# EAGLE design test (EAGLE 9.0.0)
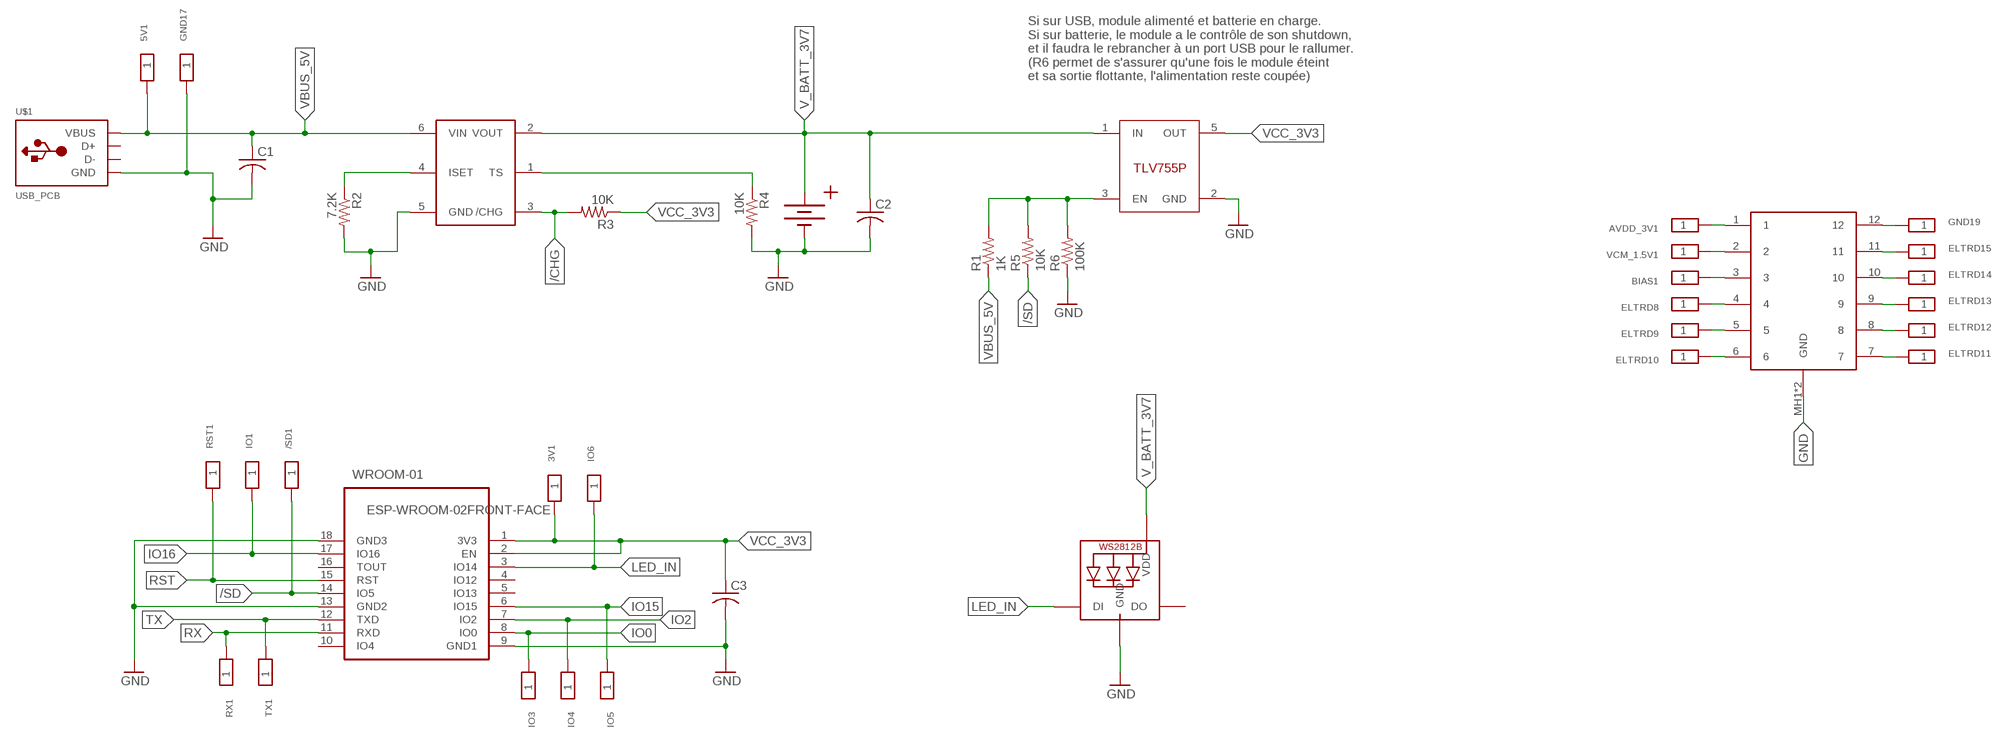
[diagram p0: schematic, sheet 1]

## Parts
3V1  TESTPAD_PROG  [TP1.5MM]
5V1  TESTPAD_PROG  [TP1.5MM]
/SD1  TESTPAD_PROG  [TP1.5MM]
AVDD_3V1  TESTPAD_PROG  [TP1.5MM]
BIAS1  TESTPAD_PROG  [TP1.5MM]
C1  C-USC0603  [C0603]
C2  C-USC0603  [C0603]
C3  C-USC0603  [C0603]
CHG1  BQ21040  [SOT23-6]
CONN1  505110-1292  [505110-1292]
ELTRD8  TESTPAD_PROG  [TP1.5MM]
ELTRD9  TESTPAD_PROG  [TP1.5MM]
ELTRD10  TESTPAD_PROG  [TP1.5MM]
ELTRD11  TESTPAD_PROG  [TP1.5MM]
ELTRD12  TESTPAD_PROG  [TP1.5MM]
ELTRD13  TESTPAD_PROG  [TP1.5MM]
ELTRD14  TESTPAD_PROG  [TP1.5MM]
ELTRD15  TESTPAD_PROG  [TP1.5MM]
GND17  TESTPAD_PROG  [TP1.5MM]
GND19  TESTPAD_PROG  [TP1.5MM]
IO1  TESTPAD_PROG  [TP1.5MM]
IO3  TESTPAD_PROG  [TP1.5MM]
IO4  TESTPAD_PROG  [TP1.5MM]
IO5  TESTPAD_PROG  [TP1.5MM]
IO6  TESTPAD_PROG  [TP1.5MM]
LDO1  TLV755P  [SOT23-5]
LED1  WS2812B5050  [WS2812B]
R1  1K  R-US_R0603  [R0603]
R2  7.2K  R-US_R0603  [R0603]
R3  10K  R-US_R0603  [R0603]
R4  10K  R-US_R0603  [R0603]
R5  10K  R-US_R0603  [R0603]
R6  100K  R-US_R0603  [R0603]
RST1  TESTPAD_PROG  [TP1.5MM]
RX1  TESTPAD_PROG  [TP1.5MM]
TX1  TESTPAD_PROG  [TP1.5MM]
U$1  USB_PCB  [USB_PADS]
U$3  BATT  [BATT_CON]
VCM_1.5V1  TESTPAD_PROG  [TP1.5MM]
WROOM-01  ESP-WROOM-02FRONT-FACE  [FRONT-FACE]

## Nets
/CHG: CHG1.3(/CHG) R3.2
/SD: /SD1.1 R5.1 WROOM-01.14(IO5)
AVDD_3V1: AVDD_3V1.1 CONN1.1
BIAS1: BIAS1.1 CONN1.3
ELTRD8: CONN1.4 ELTRD8.1
ELTRD9: CONN1.5 ELTRD9.1
ELTRD10: CONN1.6 ELTRD10.1
ELTRD11: CONN1.7 ELTRD11.1
ELTRD12: CONN1.8 ELTRD12.1
ELTRD13: CONN1.9 ELTRD13.1
ELTRD14: CONN1.10 ELTRD14.1
ELTRD15: CONN1.11 ELTRD15.1
EN1: LDO1.3(EN) R1.2 R5.2 R6.2
GND: C1.2 C2.2 C3.2 CHG1.5(GND) CONN1.MH1(GND) CONN1.MH2(GND) GND17.1 LDO1.2(GND) LED1.3-GND(GND) R2.2 R4.2 R6.1 U$1.GND U$3.V-(-) WROOM-01.9(GND1) WROOM-01.13(GND2) WROOM-01.18(GND3)
IO0: IO3.1 WROOM-01.8(IO0)
IO2: IO4.1 WROOM-01.7(IO2)
IO15: IO5.1 WROOM-01.6(IO15)
IO16: IO1.1 WROOM-01.17(IO16)
ISET1: CHG1.4(ISET) R2.1
LED_IN: IO6.1 LED1.4-DIN(DI) WROOM-01.3(IO14)
N$1: CONN1.12 GND19.1
RST: RST1.1 WROOM-01.15(RST)
RX: RX1.1 WROOM-01.11(RXD)
TS1: CHG1.1(TS) R4.1
TX: TX1.1 WROOM-01.12(TXD)
V_BATT_3V7: C2.1 CHG1.2(VOUT) LDO1.1(IN) LED1.1-VDD(VDD) U$3.V+(+)
VBUS_5V: 5V1.1 C1.1 CHG1.6(VIN) R1.1 U$1.V_SUPPLY(VBUS)
VCC_3V3: 3V1.1 C3.1 LDO1.5(OUT) R3.1 WROOM-01.1(3V3) WROOM-01.2(EN)
VCM_1.5V1: CONN1.2 VCM_1.5V1.1
Unconnected: LED1.2-DOUT(DO) U$1.D+ U$1.D- WROOM-01.4(IO12) WROOM-01.5(IO13) WROOM-01.10(IO4) WROOM-01.16(TOUT)

## Notes on the sheet
- Si sur USB, module alimenté et batterie en charge.
  Si sur batterie, le module a le contrôle de son shutdown,
  et il faudra le rebrancher à un port USB pour le rallumer.
  (R6 permet de s'assurer qu'une fois le module éteint
  et sa sortie flottante, l'alimentation reste coupée)

## Library data of the parts
3V1 5V1 /SD1 GND17 IO1 IO3-IO6 RST1 RX1 TX1 = monoblink_wifi:TESTPAD_PROG: TESTPAD
AVDD_3V1 BIAS1 ELTRD8-ELTRD15 GND19 VCM_1.5V1 = NM_Visual_Cortex:TESTPAD_PROG: TESTPAD
C1-C3 = monoblink_wifi:C-US: CAPACITOR, American symbol; SPICEPREFIX: C
CHG1 = monoblink_wifi:BQ21040
CONN1 = NM_Visual_Cortex:505110-1292
LDO1 = monoblink_wifi:TLV755P
LED1 = monoblink_wifi:WS2812B
R1-R6 = monoblink_wifi:R-US_: RESISTOR, American symbol; SPICEPREFIX: R
U$1 = monoblink_wifi:USB_PCB
U$3 = monoblink_wifi:BATT
WROOM-01 = monoblink_wifi:ESP-WROOM-02: WiFi module - ESP-WROOM-02

## Board
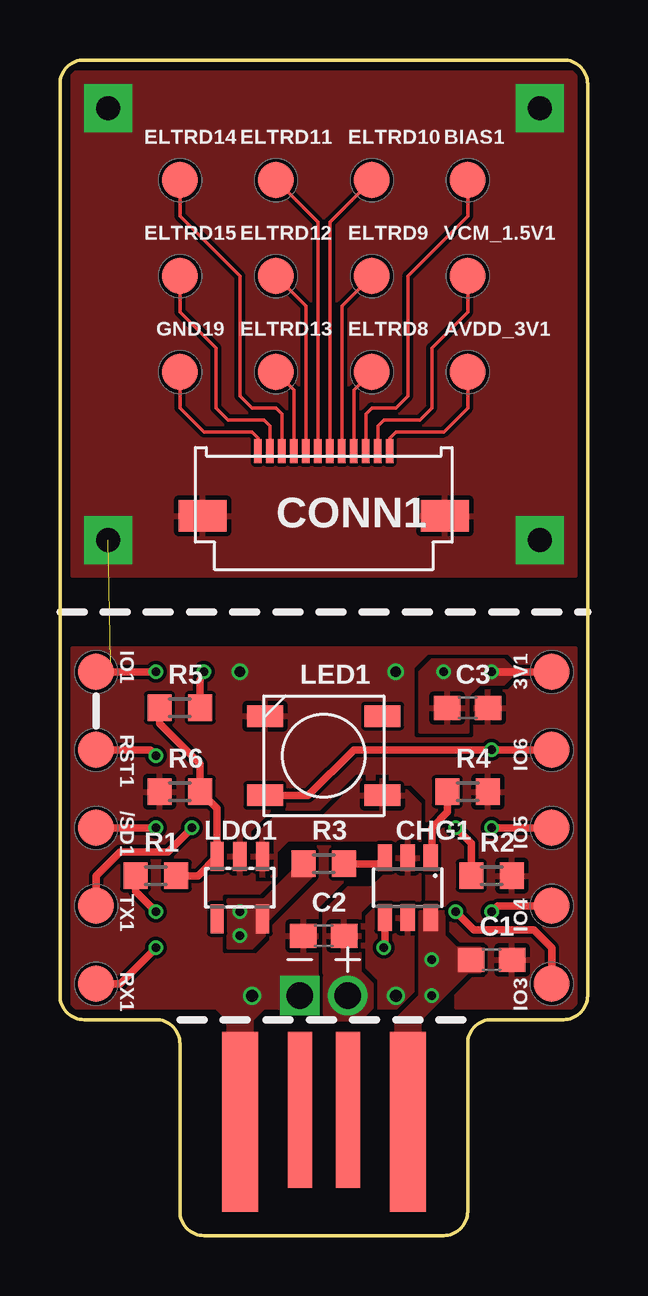
[diagram p1: board, top side]
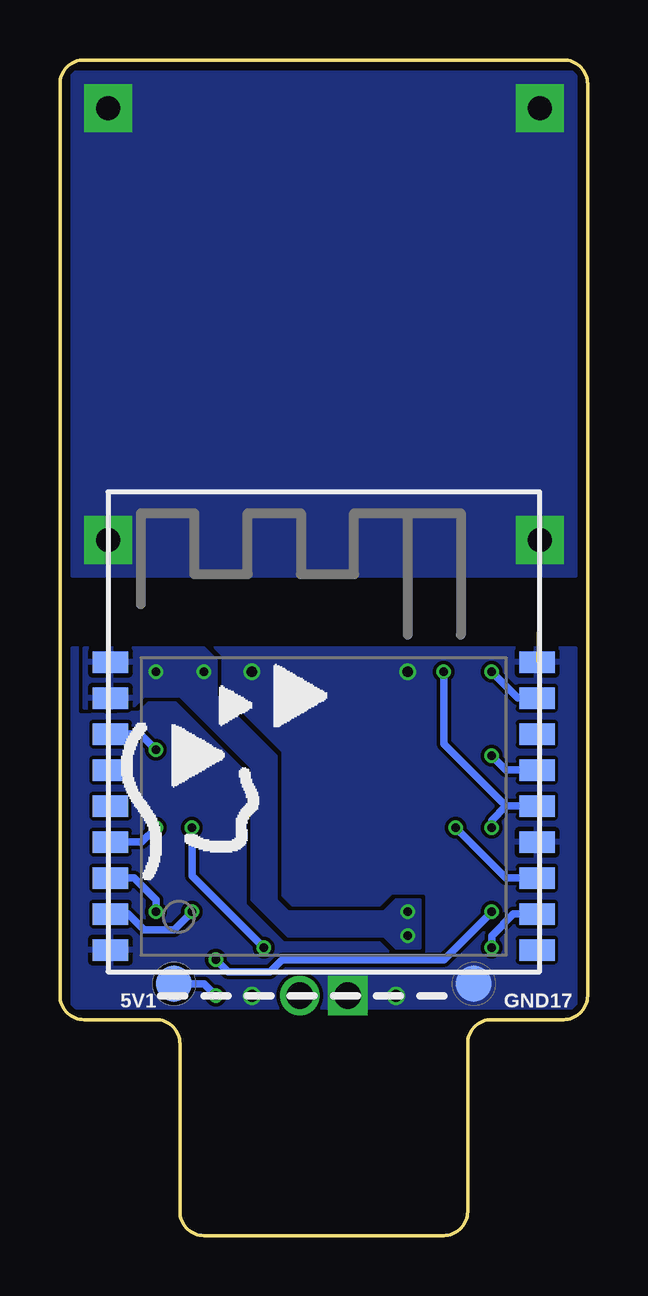
[diagram p2: board, bottom side, seen from below]

Size 22 x 49 mm. Coordinates in mm from the lower left corner, seen from the top.
Outline: 21,9 arc90 22,10 22,48 arc90 21,49 1,49 arc90 0,48 0,10 arc90 1,9 4,9 arc-90 5,8 5,1 arc90 6,0 16,0 arc90 17,1 17,8 arc-90 18,9 21,9
Copper layers (1*16): Top 0.018mm / dielectric 1.55mm / Bottom 0.018mm
Design rules "eC_2Layer_PClass6_BaseCopperO18_eCDefault": minimum track width 0.15mm, minimum drill 0.35mm, track to track 0.15mm, track to pad 0.15mm, pad to pad 0.15mm, via to via 0.15mm, smd to smd 0mil, copper to edge 0.25mm, drill to drill 0.35mm, minimum pad ring 0.175mm, minimum via ring 0.125mm, stop-mask expansion 0mil, vias tented up to drill 0.45mm, thermal gap 0.2mm

### Footprints (pad centres in the part's own frame; a part is rotated, then mirrored left to right if it is on the bottom)
TP1.5MM = smd 1.5 x 1.5: 1 0,0
C0603 = smd 1.1 x 1: 1 -0.85,0; 2 0.85,0
SOT23-6 = smd 0.6 x 1.1: 1 -0.95,-1.25; 2 0,-1.25; 3 0.95,-1.25; 4 0.95,1.25; 5 0,1.25; 6 -0.95,1.25
505110-1292 = smd 0.3 x 1: 1 -2.75,-2.7; 2 -2.25,-2.7; 3 -1.75,-2.7; 4 -1.25,-2.7; 5 -0.75,-2.7; 6 -0.25,-2.7; 7 0.25,-2.7; 8 0.75,-2.7; 9 1.25,-2.7; 10 1.75,-2.7; 11 2.25,-2.7; 12 2.75,-2.7 | smd 2 x 1.3: MH1 -5.05,0; MH2 5.05,0
SOT23-5 = smd 0.55 x 1.2: 1 -0.95,-1.3; 2 0,-1.3; 3 0.95,-1.3; 4 0.95,1.3; 5 -0.95,1.3
WS2812B = smd 1.5 x 0.9: 1-VDD 2.45,-1.65; 2-DOUT 2.45,1.65; 3-GND -2.45,1.65; 4-DIN -2.45,-1.65
R0603 = smd 1 x 1.1: 1 -0.85,0; 2 0.85,0
USB_PADS = smd 1 x 6.5: D+ 1,3.25; D- -1,3.25 | smd 1.5 x 7.5: GND 3.5,3.75; V_SUPPLY -3.5,3.75
BATT_CON = drill 1.1 pad 1.6: V+ 0,0 | drill 1.1 pad 1.6 square: V- 2,0
FRONT-FACE = smd 1.485 x 0.9: 1 -8.893,4.9; 2 -8.893,3.4; 3 -8.893,1.9; 4 -8.893,0.4; 5 -8.893,-1.1; 6 -8.893,-2.6; 7 -8.893,-4.1; 8 -8.893,-5.6; 9 -8.893,-7.1; 10 8.893,-7.1; 11 8.893,-5.6; 12 8.893,-4.1; 13 8.893,-2.6; 14 8.893,-1.1; 15 8.893,0.4; 16 8.893,1.9; 17 8.893,3.4; 18 8.893,4.9

### Placement (x,y rotation side)
3V1  20.5,23.5 0 top
5V1  17.25,10.5 0 bottom
/SD1  1.5,17 0 top
AVDD_3V1  17,36 0 top
BIAS1  17,44 0 top
C1  18,11.5 0 top
C2  11,12.5 180 top
C3  17,22 0 top
CHG1  14.5,14.5 180 top
CONN1  11,30 180 top
ELTRD8  13,36 0 top
ELTRD9  13,40 0 top
ELTRD10  13,44 0 top
ELTRD11  9,44 0 top
ELTRD12  9,40 0 top
ELTRD13  9,36 0 top
ELTRD14  5,44 0 top
ELTRD15  5,40 0 top
GND17  4.75,10.5 0 bottom
GND19  5,36 0 top
IO1  1.5,23.5 0 top
IO3  20.5,10.5 0 top
IO4  20.5,13.75 0 top
IO5  20.5,17 0 top
IO6  20.5,20.25 0 top
LDO1  7.5,14.5 180 top
LED1  11,20 0 top
R1  4,15 0 top
R2  18,15 0 top
R3  11,15.5 0 top
R4  17,18.5 0 top
R5  5,22 180 top
R6  5,18.5 0 top
RST1  1.5,20.25 0 top
RX1  1.5,10.5 0 top
TX1  1.5,13.75 0 top
U$1  11,8.5 180 top
U$3  12,10 180 top
VCM_1.5V1  17,40 0 top
WROOM-01  11,19 0 bottom

### Tracks (layer width: path | path; a pad name or v marks a point on that pad's centre or on a via)
/CHG
  Top 0.305: R3.2 13.3,15.5 CHG1.3
/SD  (via drill 0.35)
  Top 0.305: R5.1 5.85,23.15 v6,23.5 | /SD1.1 v4,17
  Bottom 0.305: v6,23.5 6,20.5 3.4,17.9 | 3.4,17.9 WROOM-01.14 | 3.4,17.9 4,17.3 v4,17
AVDD_3V1
  Top 0.152: CONN1.1 13.75,33.25 14,33.5 16,33.5 17,34.5 AVDD_3V1.1
BIAS1
  Top 0.152: CONN1.3 12.75,34.25 13,34.5 14,34.5 14.5,35 14.5,40 17,42.5 BIAS1.1
ELTRD8
  Top 0.152: CONN1.4 12.25,35.25 ELTRD8.1
ELTRD9
  Top 0.152: CONN1.5 11.75,38.75 ELTRD9.1
ELTRD10
  Top 0.152: CONN1.6 11.25,42.25 ELTRD10.1
ELTRD11
  Top 0.152: CONN1.7 10.75,42.25 ELTRD11.1
ELTRD12
  Top 0.152: CONN1.8 10.25,38.75 ELTRD12.1
ELTRD13
  Top 0.152: CONN1.9 9.75,35.25 ELTRD13.1
ELTRD14
  Top 0.152: CONN1.10 9.25,34.25 9,34.5 8,34.5 7.5,35 7.5,40 5,42.5 ELTRD14.1
ELTRD15
  Top 0.152: CONN1.11 8.75,33.75 8.5,34 7,34 6.5,34.5 6.5,37 5,38.5 ELTRD15.1
EN1
  Top 0.305: R1.2 5.75,15 LDO1.3 6.55,17.8 R6.2 5.85,19.65 4.15,21.35 R5.2
GND  (via drill 0.45, 0.5 pad 0.7, 1 pad 2)  (1 unrouted)
  other vias: 8,10 7.5,23.5 14,23.5 14,10 2,47 2,29 20,29 20,47
  pour Top (rank 2): 0.5,24.5 21.5,24.5 21.5,9.5 16.5,9.5 16.5,11 5.5,11 5.5,9.5 0.5,9.5
  pour Bottom (rank 2, no thermals): 3.5,24.5 18.5,24.5 18.5,9.5 3.5,9.5
  pour Bottom (rank 2): 3.5,24.5 0.5,24.5 0.5,9.5 3.5,9.5
  pour Bottom (rank 2): 21.5,24.5 18.5,24.5 18.5,9.5 21.5,9.5
  pour Top (rank 2, no thermals): 5.5,9.5 5.5,11 16.5,11 16.5,9.5 8.5,9.5 8,9 8,8.5 7,8.5 7,9 6.5,9.5
  pour Top: 0.5,48.5 0.5,27.5 21.5,27.5 21.5,48.5
  pour Bottom: 0.5,48.5 21.5,48.5 21.5,27.5 0.5,27.5
IO0  (via drill 0.35)
  Top 0.305: IO3.1 20.5,12 19.75,12.75 17.25,12.75 v16.5,13.5
  Bottom 0.305: 19.79,13.5 WROOM-01.8 19.15,13.4 18.5,12.75 17.25,12.75 v16.5,13.5
IO2  (via drill 0.35)
  Top 0.305: v18,13.5 18.25,13.75 IO4.1
  Bottom 0.305: WROOM-01.7 18.9,14.9 18,14 v18,13.5
IO15  (via drill 0.35)
  Top 0.305: v18,17 IO5.1
  Bottom 0.305: WROOM-01.6 18.6,16.4 v18,17
IO16  (via drill 0.35)
  Top 0.305: v4,23.5 IO1.1
  Bottom 0.305: WROOM-01.17 2.9,22.4 v4,23.5
ISET1  (via drill 0.35)
  Top 0.305: 17,15.35 R2.1 17.15,16.35 v16.5,17 | v13.5,12 13.55,12.05 CHG1.4
  Bottom 0.305: v13.5,12 16.5,15 v16.5,17
LED_IN  (via drill 0.35)
  Top 0.305: LED1.4-DIN 10.35,18.35 12.25,20.25 v18,20.25 IO6.1
  Bottom 0.305: 19.79,21 WROOM-01.3 18.65,20.9 v18,20.25
N$1
  Top 0.152: CONN1.12 8.25,33.25 8,33.5 6,33.5 5,34.5 GND19.1
RST  (via drill 0.35)
  Top 0.305: v4,20 3.75,20.25 RST1.1
  Bottom 0.305: v4,20 3.4,19.4 WROOM-01.15
RX  (via drill 0.35)
  Top 0.305: RX1.1 2.5,10.5 v4,12
  Bottom 0.305: WROOM-01.11 3.1,13.4 4,12.5 v4,12
TS1
  Top 0.305: CHG1.1 15.5,15.8 15.5,17 16.15,17.65 R4.1
TX  (via drill 0.35)
  Top 0.305: TX1.1 1.5,15 2.5,16 4.5,16 v5.5,17
  Bottom 0.305: WROOM-01.12 3.4,14.9 v5.5,17
V_BATT_3V7
  Top 0.305: LED1.1-VDD 13.65,18.35 | 12,12.35 C2.1
  pour Top: 8,16.5 8,15 9,15 9,16 9.5,16.5 14,16.5 14,15 13.5,15 13,14.5 12,14.5 11,13.5 11,9 12.5,9 13,9.5 13,10.5 12.5,11 12.5,13.5 13,14 15,14 15,18 14,19 12.5,19 11,17.5 9,17.5
VBUS_5V  (via drill 0.35)
  Top 0.305: 15.5,13.2 CHG1.6 | R1.1 3.15,14.35 v4,13.5
  Bottom 0.305: v4,13.5 6,11.5 12.75,11.5 13.25,11 15,11 v15.5,11.5 | v15.5,10 16,10.5 5V1.1
  pour Top (no thermals): 14,1.5 15,1.5 15,9 17,11 17.5,11 17.5,12 16.5,12 16,12.5 16,13.5 15,13.5 15,10 14,9
VCC_3V3  (via drill 0.35)
  Top 0.305: v18,23.5 3V1.1
  other vias: 16,23.5 7.5,12.5 7.5,13.5
  pour Bottom: 21,22 21,24.5 16,24.5 15.5,24 15.5,22.5 13,20 13,14 12.5,13.5 8.5,13.5 8,14 7,14 7,12 8,12 8.5,12.5 12.5,12.5 14,14 14,19.5 17,22.5 18.5,22.5 19,22
  pour Top (no thermals): 15,23 18.5,23 19,23.5 18.5,24 15.5,24 15,23.5
  pour Top (no thermals): 7,14 7,12 8,12 8.5,12.5 8.5,13 10.5,15 10.5,16 10,16 10,15.5 8.5,14
  pour Top: 15,23 15,21 17,21 17,22.5 17.5,23
VCM_1.5V1
  Top 0.152: CONN1.2 13.25,33.75 13.5,34 15,34 15.5,34.5 15.5,37 17,38.5 VCM_1.5V1.1